# Altium schematic sheet Main Power Switch.SchDoc: Main Power Switch
size A4; DocumentNumber: 6; SheetNumber: 6; SheetTotal: 54
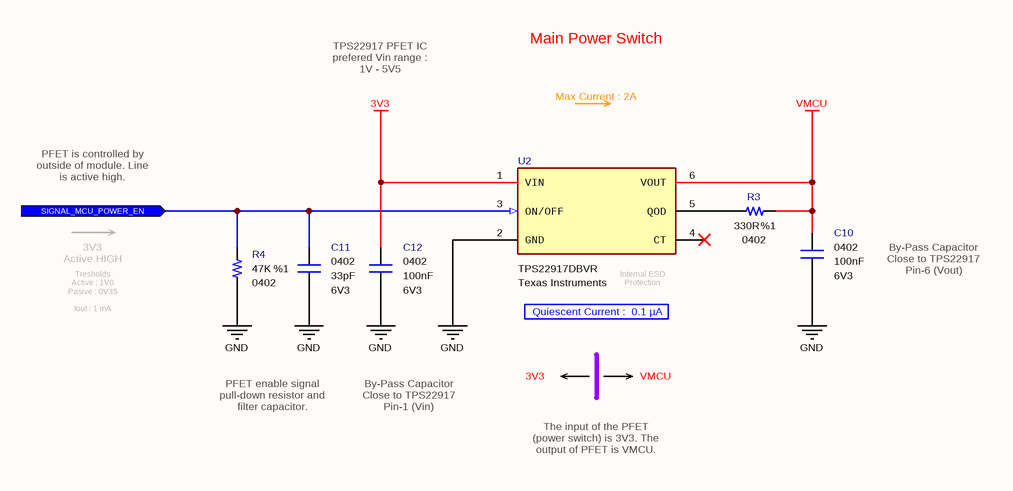
[diagram p0: Main Power Switch.SchDoc]

## Parts
C10  value 100nF  Case: 0402  Voltage: 6V3  [CAPACITOR_0402]  (hidden comment: Multilayer Ceramic Capacitor)
C11  value 33pF  Case: 0402  Voltage: 6V3  [CAPACITOR_0402]  (hidden comment: Multilayer Ceramic Capacitor)
C12  value 100nF  Case: 0402  Voltage: 6V3  [CAPACITOR_0402]  (hidden comment: Multilayer Ceramic Capacitor)
R3  value 330R  Tolerance: %1  Case: 0402  [RESISTOR_0402]  (hidden comment: Thick Film Resistor)
R4  value 47K  Tolerance: %1  Case: 0402  [RESISTOR_0402]  (hidden comment: Thick Film Resistor)
U2  Manufacturer Part Number: TPS22917DBVR  Manufacturer Name: Texas Instruments  [SOT-23-6]  (hidden comment: Power Switch)

## Ports
SIGNAL_MCU_POWER_EN (in)

## Nets
3V3: C12.1 U2.1(VIN)
GND: C10.2 C11.1 C12.2 R4.1 U2.2(GND)
VMCU: C10.1 R3.1 U2.6(VOUT)
SIGNAL_MCU_POWER_EN: C11.2 R4.2 U2.3(ON/OFF) ; port SIGNAL_MCU_POWER_EN
NetR3_2: R3.2 U2.5(QOD)

Not connected (* = marked no-connect by the designer): U2 4(CT)*

## Notes on the sheet
- Main Power Switch
- TPS22917 PFET IC prefered Vin range : 1V - 5V5
- Max Current : 2A
- PFET is controlled by outside of module. Line is active high.
- 3V3
  Active HIGH
- (near U2) Internal ESD Protection
- By-Pass Capacitor
  Close to TPS22917
  Pin-6 (Vout)
- Tresholds
  Active : 1V0
  Pasive : 0V35
  Iout : 1 mA
- Quiescent Current :  0.1 µA
- PFET enable signal pull-down resistor and filter capacitor.
- By-Pass Capacitor
  Close to TPS22917
  Pin-1 (Vin)
- 3V3
- VMCU
- The input of the PFET (power switch) is 3V3. The output of PFET is VMCU.
- Engineer
- All Rights are reserved to Customer and Engineer. [2021]
- Size:
- Date:
- A4
- Project :
- Time:
- Sheet
- of
- Customer
- Product ID
- Module ID
- Version
- File:
- Revision

## Library data of the parts
C10 C12 = Capacitor - 100nF [0402-6V3]: Capacitor - 100nF [0402-6V3] (Ceramic); Manufacturer Name: AVX; Manufacturer Part Number: 04026D104KAT4A; Dielectric: X5R; Tolerance: %10; Height: 0.25mm; ComponentLink1Description: Mouser; ComponentLink1URL: https://www.mouser.com.tr/ProductDetail/AVX/04026D104KAT4A?qs=sGAEpiMZZMs0AnBnWHyRQPg4iYkCw7IMED%2F4kpqgf7w%3D; ComponentLink2Description: DataSheet; ComponentLink2URL: https://www.mouser.com.tr/datasheet/2/40/cx5r-776519.pdf; ROHS: Yes; Maximum Operating Temperature: +85; Minimum Operating Temperature: -55; Supplier 1: Avnet; Supplier Part Number 1: 04026D104KAT4A; Mouser Part Number: 581-04026D104KAT4A
C11 = Capacitor - 33pF [0402-6V3]: Capacitor - 33pF [0402] (Ceramic); Manufacturer Name: Kemet; Manufacturer Part Number: C0402C330J9RACAUTO; Dielectric: X7R; Tolerance: 10%; Height: 0.5mm; Maximum Operating Temperature: +125; Minimum Operating Temperature: -55; ROHS: Yes; ComponentLink1Description: DataSheet; ComponentLink1URL: https://api.kemet.com/component-edge/download/datasheet/C0402C330J9RACAUTO.pdf; ComponentLink2Description: Mouser; ComponentLink2URL: https://www.mouser.com/Search/Refine.aspx?Keyword=80-C0402C330J9RAUTO; Supplier 1: Mouser; Supplier Part Number 1: 80-C0402C330J9RAUTO; Mouser Part Number: 80-C0402C330J9RAUTO
R3 = Resistor - 330R: Thick Film Resistors - SMD 1/16 W 330 Ohm 1%; Manufacturer Name: Vishay; Manufacturer Part Number: CRCW0402330RFKED; Height: 0.4mm; ComponentLink1Description: DataSheet; ComponentLink1URL: https://www.mouser.com.tr/datasheet/2/427/dcrcwe3-1762152.pdf; ComponentLink2Description: Mouser; ComponentLink2URL: https://www.mouser.com.tr/ProductDetail/Vishay-Dale/CRCW0402330RFKED?qs=sGAEpiMZZMu61qfTUdNhG2DpbjADlD3GGS6SwBlLi5Q%3D; Supplier 1: Mouser; Supplier 2: Digi-Key; Supplier Part Number 2: 541-330LCT-ND; Supplier Part Number 1: 71-CRCW0402-330-E3; Mouser Part Number: 71-CRCW0402-330-E3
R4 = Resistor - 47K: Thick Film Resistors - SMD 1/16 W 47 Kohms 1%; Manufacturer Name: Vishay; Manufacturer Part Number: CRCW040247K0FKED; Height: 0.4mm; ComponentLink1Description: DataSheet; ComponentLink1URL: https://www.mouser.com.tr/datasheet/2/427/dcrcwe3-1762152.pdf; ComponentLink2Description: Mouser; ComponentLink2URL: https://www.mouser.com.tr/ProductDetail/Vishay-Dale/CRCW040247K0FKED?qs=sGAEpiMZZMu61qfTUdNhG2DpbjADlD3GL%252B3h1elTxqU%3D; Supplier 1: Mouser; Supplier 2: Digi-Key; Supplier Part Number 1: 71-CRCW040247K0FKEDH; Supplier Part Number 2: 541-47.0KYCT-ND; Mouser Part Number: 71-CRCW0402-47K-E3
U2 = IC - TPS22917DBVR: Power Switch MosFet; Height: 1.45mm; ComponentLink1Description: DataSheet; ComponentLink1URL: http://www.ti.com/lit/gpn/tps22917; ComponentLink2Description: Mouser; ComponentLink2URL: https://www.mouser.com/Search/Refine.aspx?Keyword=595-TPS22917DBVR; Supplier 1: Mouser; Supplier 2: Digi-Key; Supplier Part Number 1: 595-TPS22917DBVR; Supplier Part Number 2: 296-50498-1-ND; Mouser Part Number: 595-TPS22917DBVR; Case: SOT-23-6